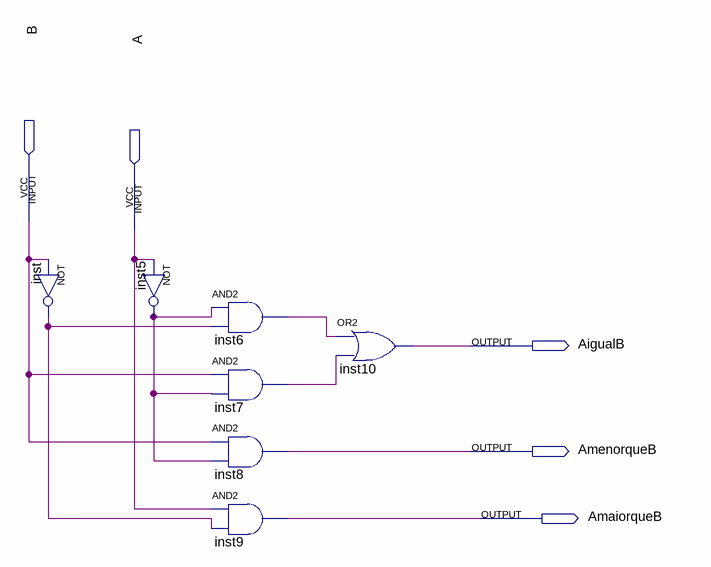
[diagram p0: schematic sheet]
// Quartus schematic COMPARADOR2BITS.bdf as structural Verilog: 7 symbols, 5 pins
module COMPARADOR2BITS (
  input  B,
  input  A,
  output AigualB,
  output AmenorqueB,
  output AmaiorqueB
);

  wire inst5_out, inst6_out, inst7_out, inst_out;

  not inst (inst_out, B);
  not inst5 (inst5_out, A);
  and inst6 (inst6_out, inst5_out, inst_out);
  and inst7 (inst7_out, B, inst5_out);
  and inst8 (AmenorqueB, B, inst5_out);
  and inst9 (AmaiorqueB, A, inst_out);
  or inst10 (AigualB, inst6_out, inst7_out);
endmodule
